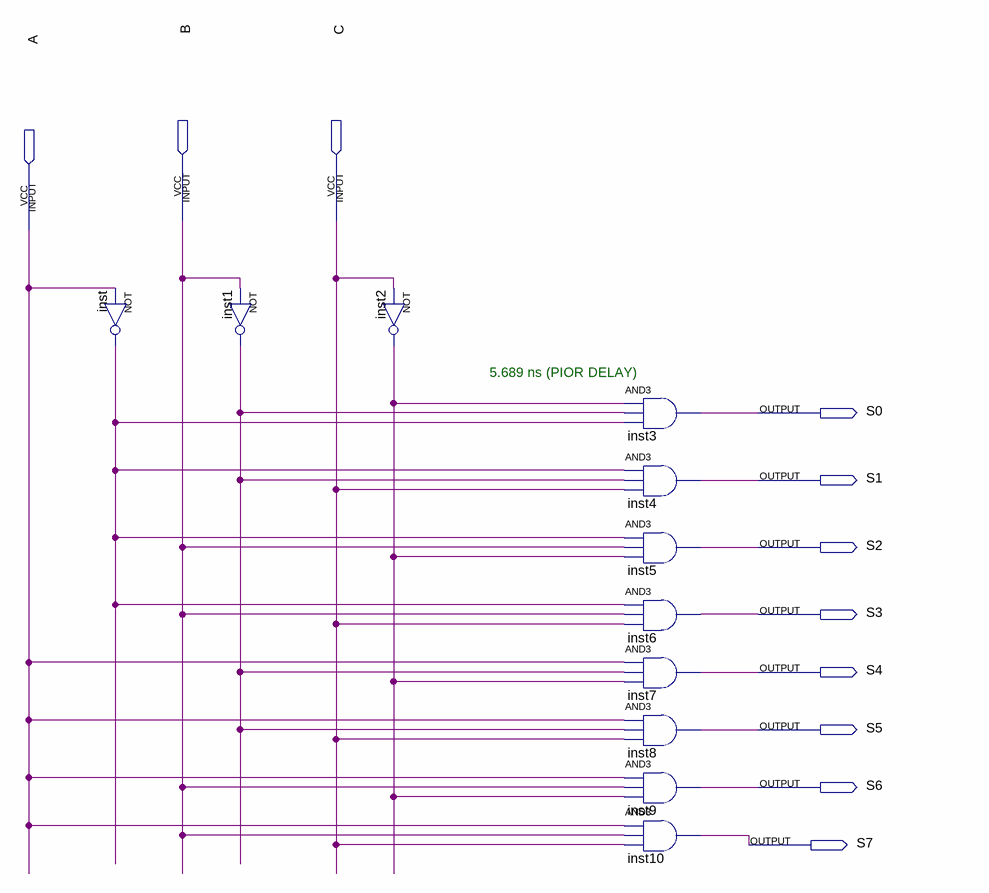
[diagram p0: schematic sheet]
// Quartus schematic DECODER3_8.bdf as structural Verilog: 11 symbols, 11 pins
module DECODER3_8 (
  input  B,
  input  C,
  input  A,
  output S0,
  output S1,
  output S2,
  output S3,
  output S4,
  output S5,
  output S6,
  output S7
);

  wire inst1_out, inst2_out, inst_out;

  not inst (inst_out, A);
  not inst1 (inst1_out, B);
  not inst2 (inst2_out, C);
  and inst3 (S0, inst2_out, inst1_out, inst_out);
  and inst4 (S1, inst_out, inst1_out, C);
  and inst5 (S2, inst_out, B, inst2_out);
  and inst6 (S3, inst_out, B, C);
  and inst7 (S4, A, inst1_out, inst2_out);
  and inst8 (S5, A, inst1_out, C);
  and inst9 (S6, A, B, inst2_out);
  and inst10 (S7, A, B, C);

  // Notes on the sheet:
  //   5.689 ns (PIOR DELAY)
endmodule
